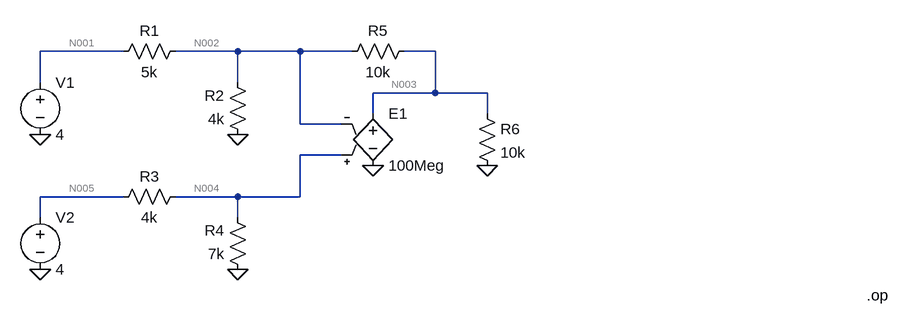
[diagram p0: schematic HW05P03.asc]
HW05P03.asc, the LTspice schematic file:
Version 4
SHEET 1 1344 680
WIRE 160 32 32 32
WIRE 336 32 240 32
WIRE 432 32 336 32
WIRE 512 32 432 32
WIRE 640 32 592 32
WIRE 32 80 32 32
WIRE 336 80 336 32
WIRE 640 96 640 32
WIRE 640 96 544 96
WIRE 720 96 640 96
WIRE 544 128 544 96
WIRE 720 128 720 96
WIRE 432 144 432 32
WIRE 496 144 432 144
WIRE 496 192 432 192
WIRE 160 256 32 256
WIRE 336 256 240 256
WIRE 432 256 432 192
WIRE 432 256 336 256
WIRE 32 288 32 256
WIRE 336 288 336 256
FLAG 32 160 0
FLAG 336 160 0
FLAG 32 368 0
FLAG 336 368 0
FLAG 544 208 0
FLAG 720 208 0
DATAFLAG 704 96 ""
DATAFLAG 336 256 ""
SYMBOL voltage 32 64 R0
SYMATTR InstName V1
SYMATTR Value 4
SYMBOL res 256 16 R90
WINDOW 0 0 56 VBottom 2
WINDOW 3 32 56 VTop 2
SYMATTR InstName R1
SYMATTR Value 5k
SYMBOL res 352 176 R180
WINDOW 0 36 76 Left 2
WINDOW 3 36 40 Left 2
SYMATTR InstName R2
SYMATTR Value 4k
SYMBOL voltage 32 272 R0
SYMATTR InstName V2
SYMATTR Value 4
SYMBOL res 256 240 R90
WINDOW 0 0 56 VBottom 2
WINDOW 3 32 56 VTop 2
SYMATTR InstName R3
SYMATTR Value 4k
SYMBOL res 352 384 R180
WINDOW 0 36 76 Left 2
WINDOW 3 36 40 Left 2
SYMATTR InstName R4
SYMATTR Value 7k
SYMBOL e2 544 112 R0
SYMATTR InstName E1
SYMATTR Value 100Meg
SYMBOL res 608 16 R90
WINDOW 0 0 56 VBottom 2
WINDOW 3 32 56 VTop 2
SYMATTR InstName R5
SYMATTR Value 10k
SYMBOL res 704 112 R0
SYMATTR InstName R6
SYMATTR Value 10k
TEXT 1304 408 Left 2 !.op

The netlist it stands for:
* HW05P03.asc
V1 N001 0 4
R1 N002 N001 5k
R2 0 N002 4k
V2 N005 0 4
R3 N004 N005 4k
R4 0 N004 7k
E1 N003 0 N004 N002 100Meg
R5 N003 N002 10k
R6 N003 0 10k
.op
.backanno
.end

* Results of the author's LTspice run, read from the files saved beside the schematic
* Operating Point:
*   V(n001) = 4 V
*   V(n002) = 2.545 V
*   V(n005) = 4 V
*   V(n004) = 2.545 V
*   V(n003) = 6 V
*   I(R1) = -290.9 µA
*   I(R2) = -636.4 µA
*   I(R3) = -363.6 µA
*   I(R4) = -363.6 µA
*   I(R5) = 345.5 µA
*   I(R6) = 600 µA
*   I(E1) = -945.5 µA
*   I(V1) = -290.9 µA
*   I(V2) = -363.6 µA